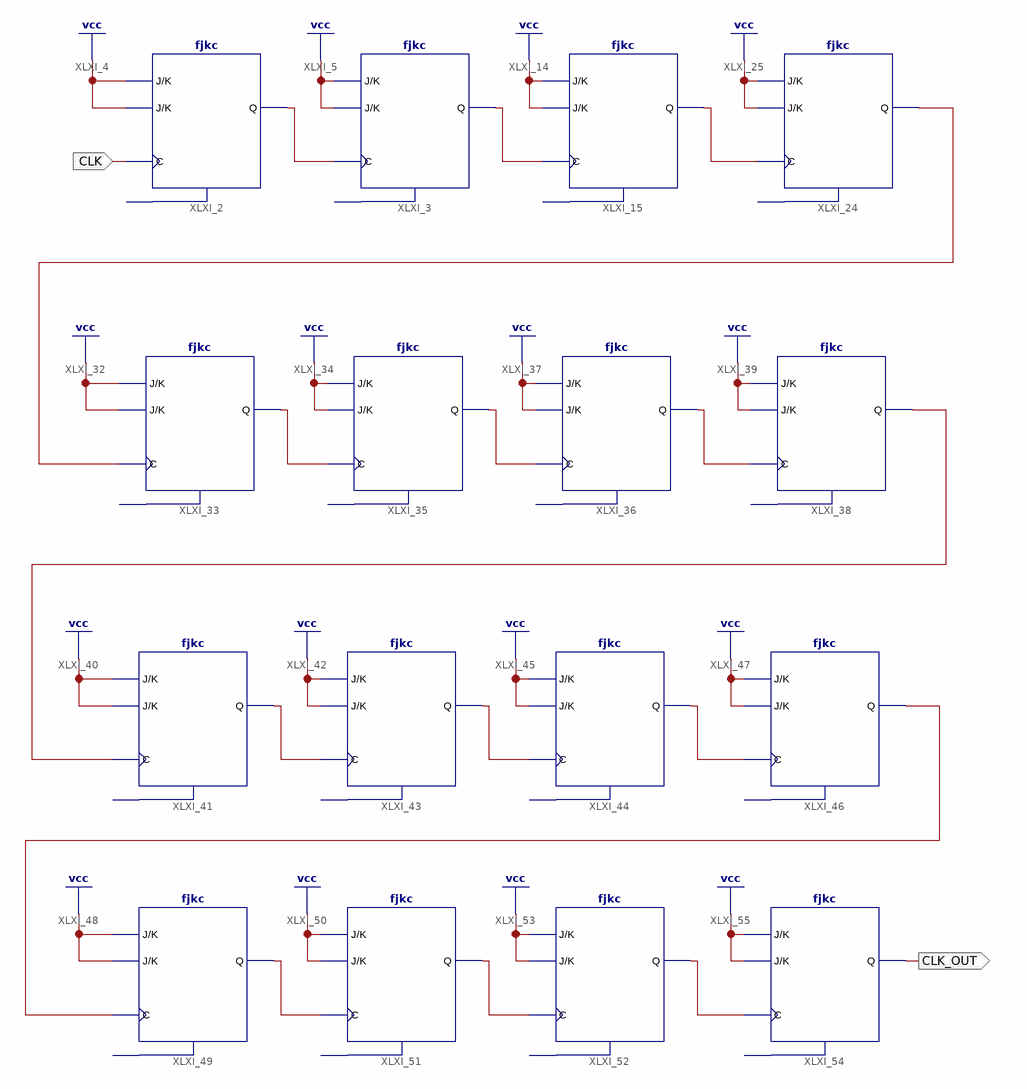
[diagram p0: schematic sheet 1]
// Xilinx ISE schematic div.sch (spartan6) as structural Verilog: 16 symbols, 2 ports
module div (
  input  CLK,
  output CLK_OUT
);

  wire XLXN_3, XLXN_24, XLXN_35, XLXN_45, XLXN_47, XLXN_49, XLXN_53, XLXN_55, XLXN_57, XLXN_61, XLXN_63,
       XLXN_65, XLXN_66, XLXN_67, XLXN_68;

  fjkc XLXI_3 (.C(XLXN_3), .J(1'b1), .K(1'b1), .Q(XLXN_24));  // open: CLR
  fjkc XLXI_2 (.C(CLK), .J(1'b1), .K(1'b1), .Q(XLXN_3));  // open: CLR
  fjkc XLXI_15 (.C(XLXN_24), .J(1'b1), .K(1'b1), .Q(XLXN_35));  // open: CLR
  fjkc XLXI_24 (.C(XLXN_35), .J(1'b1), .K(1'b1), .Q(XLXN_66));  // open: CLR
  fjkc XLXI_33 (.C(XLXN_66), .J(1'b1), .K(1'b1), .Q(XLXN_45));  // open: CLR
  fjkc XLXI_35 (.C(XLXN_45), .J(1'b1), .K(1'b1), .Q(XLXN_47));  // open: CLR
  fjkc XLXI_36 (.C(XLXN_47), .J(1'b1), .K(1'b1), .Q(XLXN_49));  // open: CLR
  fjkc XLXI_38 (.C(XLXN_49), .J(1'b1), .K(1'b1), .Q(XLXN_67));  // open: CLR
  fjkc XLXI_41 (.C(XLXN_67), .J(1'b1), .K(1'b1), .Q(XLXN_53));  // open: CLR
  fjkc XLXI_43 (.C(XLXN_53), .J(1'b1), .K(1'b1), .Q(XLXN_55));  // open: CLR
  fjkc XLXI_44 (.C(XLXN_55), .J(1'b1), .K(1'b1), .Q(XLXN_57));  // open: CLR
  fjkc XLXI_46 (.C(XLXN_57), .J(1'b1), .K(1'b1), .Q(XLXN_68));  // open: CLR
  fjkc XLXI_49 (.C(XLXN_68), .J(1'b1), .K(1'b1), .Q(XLXN_61));  // open: CLR
  fjkc XLXI_51 (.C(XLXN_61), .J(1'b1), .K(1'b1), .Q(XLXN_63));  // open: CLR
  fjkc XLXI_52 (.C(XLXN_63), .J(1'b1), .K(1'b1), .Q(XLXN_65));  // open: CLR
  fjkc XLXI_54 (.C(XLXN_65), .J(1'b1), .K(1'b1), .Q(CLK_OUT));  // open: CLR
endmodule
